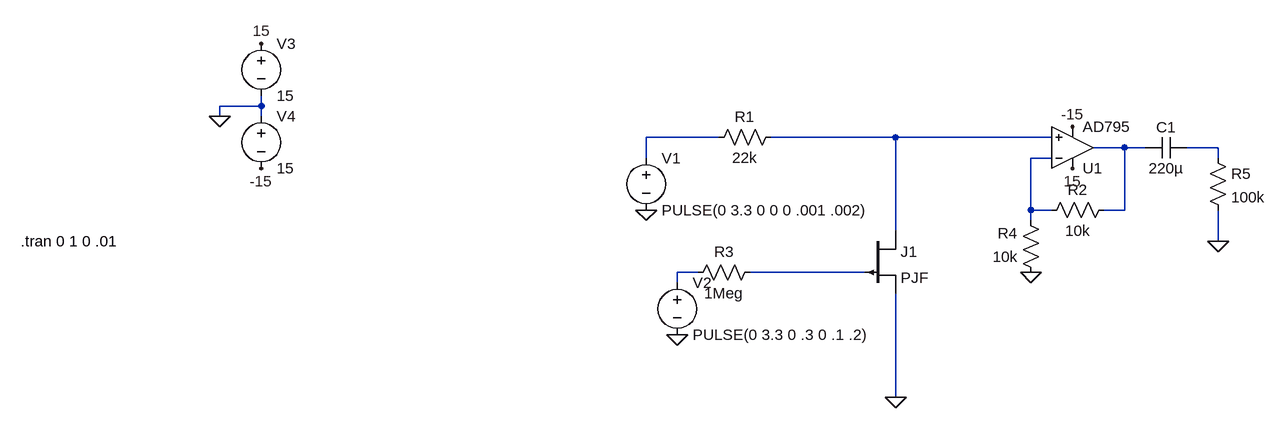
[diagram p0: schematic P-Channel JFET compressor.asc]
P-Channel JFET compressor.asc, the LTspice schematic file:
Version 4
SHEET 1 880 680
WIRE -816 0 -816 -16
WIRE -816 0 -880 0
WIRE -880 16 -880 0
WIRE -816 16 -816 0
WIRE -112 48 -224 48
WIRE 160 48 -32 48
WIRE 400 48 160 48
WIRE 512 64 464 64
WIRE 544 64 512 64
WIRE 656 64 608 64
WIRE -224 80 -224 48
WIRE 400 80 368 80
WIRE 656 80 656 64
WIRE 368 160 368 80
WIRE 400 160 368 160
WIRE 512 160 512 64
WIRE 512 160 480 160
WIRE 368 176 368 160
WIRE 160 192 160 48
WIRE 656 208 656 160
WIRE -144 256 -176 256
WIRE 112 256 -64 256
WIRE -176 272 -176 256
WIRE 160 448 160 288
FLAG -224 160 0
FLAG -176 352 0
FLAG -880 16 0
FLAG -816 -96 15
FLAG -816 96 -15
FLAG 432 32 -15
FLAG 432 96 15
FLAG 368 256 0
FLAG 160 448 0
FLAG 656 208 0
DATAFLAG -224 48 ""
DATAFLAG 160 48 ""
DATAFLAG 160 320 ""
DATAFLAG 0 256 ""
DATAFLAG -176 256 ""
SYMBOL res -16 32 R90
WINDOW 0 0 56 VBottom 2
WINDOW 3 32 56 VTop 2
SYMATTR InstName R1
SYMATTR Value 22k
SYMBOL res -160 272 R270
WINDOW 0 32 56 VTop 2
WINDOW 3 0 56 VBottom 2
SYMATTR InstName R3
SYMATTR Value 1Meg
SYMBOL voltage -224 64 R0
WINDOW 123 0 0 Left 0
WINDOW 39 0 0 Left 0
SYMATTR InstName V1
SYMATTR Value PULSE(0 3.3 0 0 0 .001 .002)
SYMBOL voltage -176 256 R0
WINDOW 123 0 0 Left 0
WINDOW 39 0 0 Left 0
SYMATTR InstName V2
SYMATTR Value PULSE(0 3.3 0 .3 0 .1 .2)
SYMBOL voltage -816 -112 R0
WINDOW 123 0 0 Left 0
WINDOW 39 0 0 Left 0
SYMATTR InstName V3
SYMATTR Value 15
SYMBOL voltage -816 0 R0
WINDOW 123 0 0 Left 0
WINDOW 39 0 0 Left 0
SYMATTR InstName V4
SYMATTR Value 15
SYMBOL Opamps\\AD795 432 128 M180
SYMATTR InstName U1
SYMBOL res 496 144 R90
WINDOW 0 0 56 VBottom 2
WINDOW 3 32 56 VTop 2
SYMATTR InstName R2
SYMATTR Value 10k
SYMBOL res 384 272 R180
WINDOW 0 36 76 Left 2
WINDOW 3 36 40 Left 2
SYMATTR InstName R4
SYMATTR Value 10k
SYMBOL cap 608 48 R90
WINDOW 0 0 32 VBottom 2
WINDOW 3 32 32 VTop 2
SYMATTR InstName C1
SYMATTR Value 220µ
SYMBOL res 640 64 R0
SYMATTR InstName R5
SYMATTR Value 100k
SYMBOL pjf 112 192 R0
SYMATTR InstName J1
TEXT -1186 208 Left 2 !.tran 0 1 0 .01

The netlist it stands for:
* P-Channel JFET compressor.asc
R1 N002 N001 22k
R3 N006 N007 1Meg
V1 N001 0 PULSE(0 3.3 0 0 0 .001 .002)
V2 N006 0 PULSE(0 3.3 0 .3 0 .1 .2)
V3 15 0 15
V4 0 -15 15
XU1 N002 N005 15 -15 N003 AD795  ; pins In+ In- V+ V- OUT
R2 N003 N005 10k
R4 0 N005 10k
C1 N004 N003 220µ
R5 N004 0 100k
J1 N002 N007 0 PJF
.model NJF NJF
.model PJF PJF
.lib standard.jft
.tran 0 1 0 .01
.lib ADI1.lib
.backanno
.end